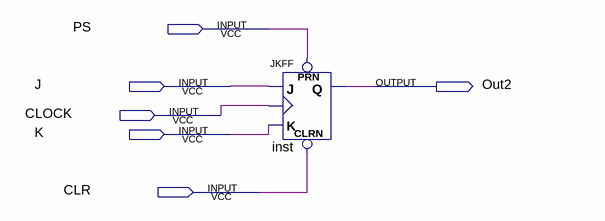
[diagram p0: schematic sheet]
// Quartus schematic test_JK.bdf as structural Verilog: 1 symbols, 6 pins
module test_JK (
  input  PS,
  input  J,
  input  CLOCK,
  input  K,
  input  CLR,
  output Out2
);

  JKFF inst (.PRN(PS), .CLRN(CLR), .K(K), .J(J), .CLK(CLOCK), .Q(Out2));
endmodule
